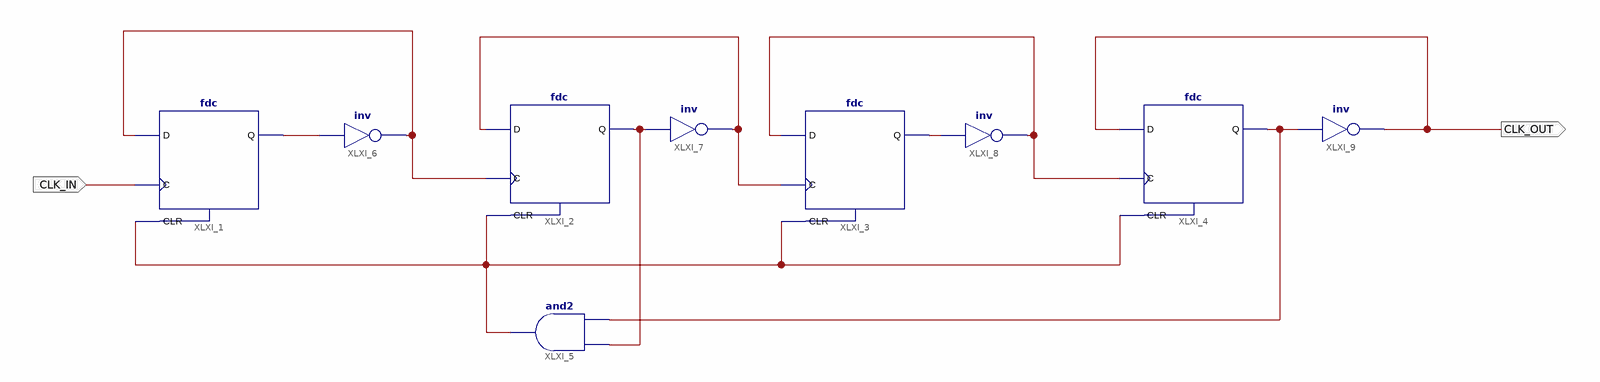
[diagram p0: schematic sheet 1]
// Xilinx ISE schematic DIV10.sch (spartan6) as structural Verilog: 9 symbols, 2 ports
module DIV10 (
  input  CLK_IN,
  output CLK_OUT
);

  wire XLXN_2, XLXN_3, XLXN_4, XLXN_5, XLXN_7, XLXN_9, XLXN_11, XLXN_18;

  fdc XLXI_1 (.C(CLK_IN), .CLR(XLXN_18), .D(XLXN_7), .Q(XLXN_2));
  fdc XLXI_2 (.C(XLXN_7), .CLR(XLXN_18), .D(XLXN_9), .Q(XLXN_3));
  fdc XLXI_3 (.C(XLXN_9), .CLR(XLXN_18), .D(XLXN_11), .Q(XLXN_4));
  fdc XLXI_4 (.C(XLXN_11), .CLR(XLXN_18), .D(CLK_OUT), .Q(XLXN_5));
  and XLXI_5 (XLXN_18, XLXN_5, XLXN_3);
  not XLXI_6 (XLXN_7, XLXN_2);
  not XLXI_7 (XLXN_9, XLXN_3);
  not XLXI_8 (XLXN_11, XLXN_4);
  not XLXI_9 (CLK_OUT, XLXN_5);
endmodule
